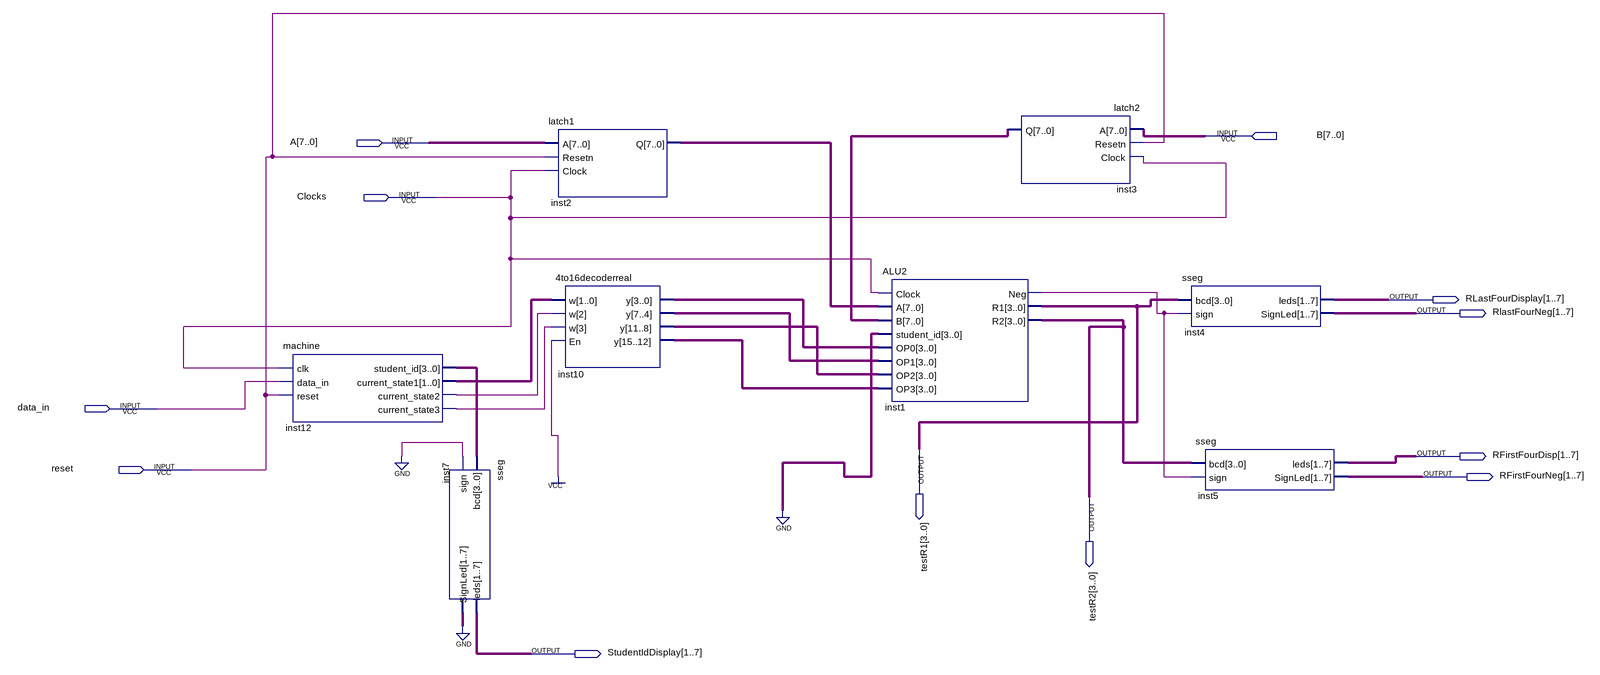
[diagram p0: schematic sheet]
// Quartus schematic SecondALUDiag.bdf as structural Verilog: 8 symbols, 12 pins
module SecondALUDiag (
  input  [7:0] B,
  input  [7:0] A,
  input  Clocks,
  input  data_in,
  input  reset,
  output [1:7] RLastFourDisplay,
  output [1:7] RlastFourNeg,
  output [3:0] testR1,
  output [1:7] RFirstFourDisp,
  output [1:7] RFirstFourNeg,
  output [3:0] testR2,
  output [1:7] StudentIdDisplay
);

  wire inst1_neg, inst12_current_state2, inst12_current_state3;
  wire [1:0] inst12_current_state1;
  wire [3:0] inst10_y, inst10_y_2, inst10_y_3, inst10_y_4, inst12_student_id;
  wire [6:0] inst7_signled;
  wire [7:0] inst2_q, inst3_q;

  machine inst12 (
    .clk(Clocks), .data_in(data_in), .reset(reset), .student_id(inst12_student_id),
    .current_state1(inst12_current_state1), .current_state2(inst12_current_state2),
    .current_state3(inst12_current_state3));
  sseg inst7 (.bcd(inst12_student_id), .sign(1'b0), .leds(StudentIdDisplay), .SignLed(inst7_signled));
  latch1 inst2 (.A(A), .Resetn(reset), .Clock(Clocks), .Q(inst2_q));
  \4to16decoderreal  inst10 (
    .w({inst12_current_state3, inst12_current_state2, inst12_current_state1}), .En(1'b1),
    .y({inst10_y_2, inst10_y_4, inst10_y, inst10_y_3}));
  ALU2 inst1 (
    .Clock(Clocks), .A(inst2_q), .B(inst3_q), .student_id(4'b0000), .OP0(inst10_y_3), .OP1(inst10_y),
    .OP2(inst10_y_4), .OP3(inst10_y_2), .Neg(inst1_neg), .R1(testR1), .R2(testR2));
  latch2 inst3 (.A(B), .Resetn(reset), .Clock(Clocks), .Q(inst3_q));
  sseg inst4 (.bcd(testR1), .sign(inst1_neg), .leds(RLastFourDisplay), .SignLed(RlastFourNeg));
  sseg inst5 (.bcd(testR2), .sign(inst1_neg), .leds(RFirstFourDisp), .SignLed(RFirstFourNeg));
  // also tied to GND on the sheet: {inst7_signled[0], inst7_signled[1], inst7_signled[2], inst7_signled[3], inst7_signled[4], inst7_signled[5], inst7_signled[6]}
endmodule
